# Altium schematic sheet isoDebug-Isolation.SchDoc
size A4
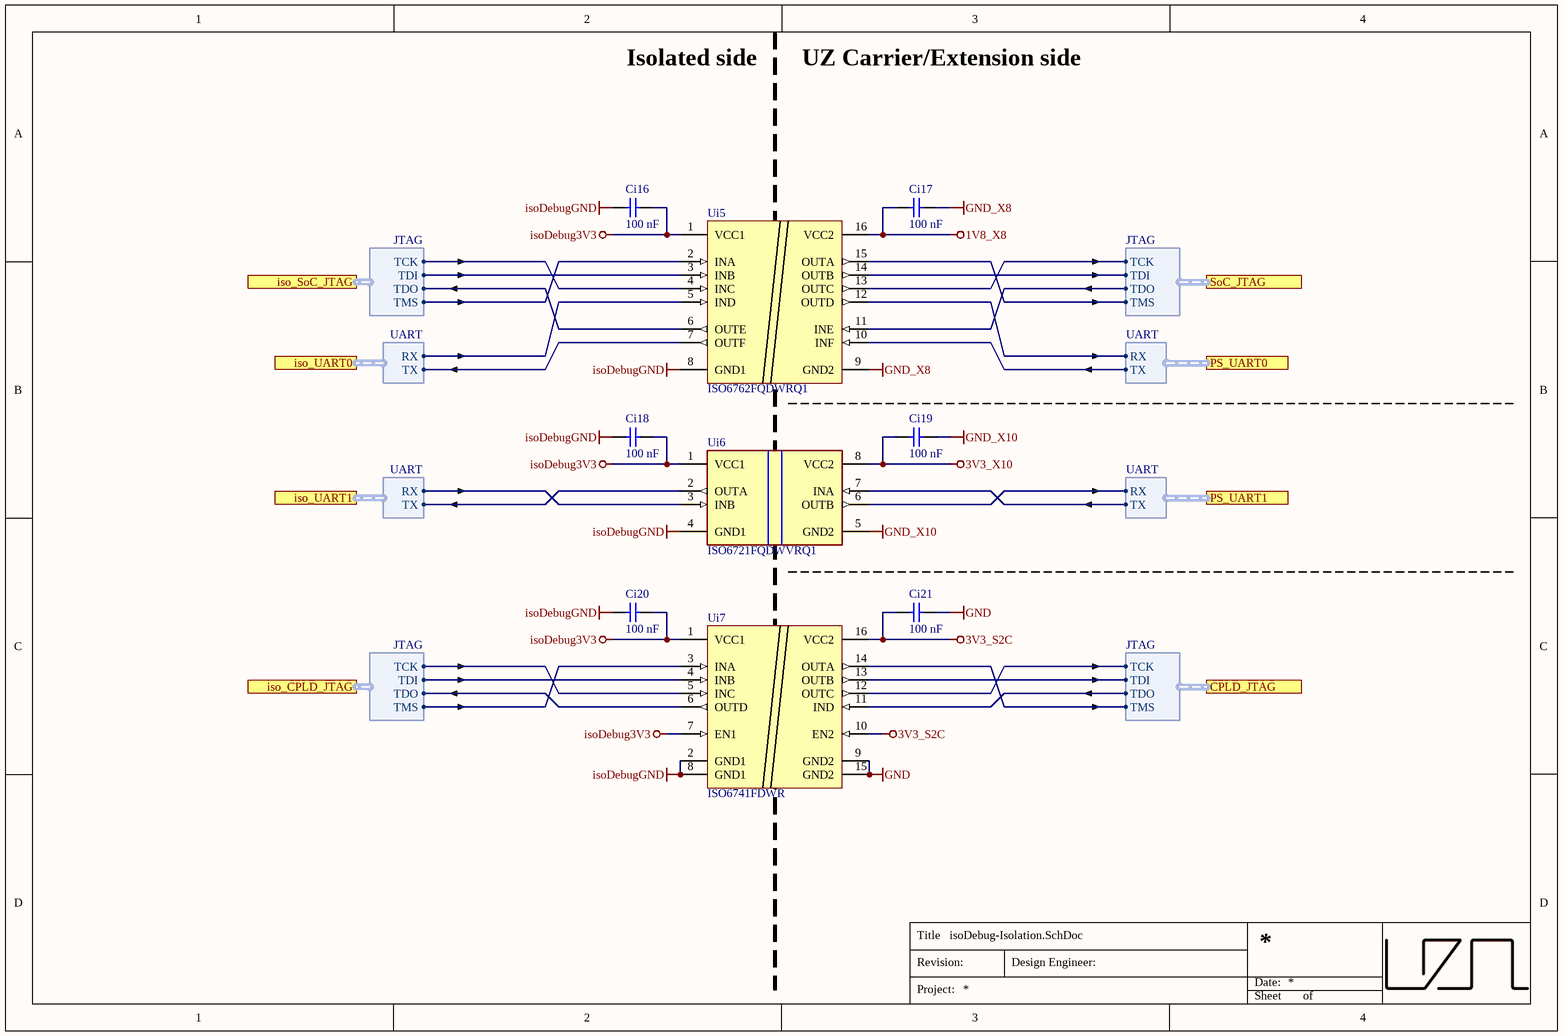
[diagram p0: isoDebug-Isolation.SchDoc]

## Parts
Ci16  100 nF  [C_0402_TE]
Ci17  100 nF  [C_0402_TE]
Ci18  100 nF  [C_0402_TE]
Ci19  100 nF  [C_0402_TE]
Ci20  100 nF  [C_0402_TE]
Ci21  100 nF  [C_0402_TE]
Ui5  ISO6762FQDWRQ1  [SOIC127P1030X265-16N]
Ui6  ISO6721FQDWVRQ1  [FP-DWV0008A-IPC_A]
Ui7  ISO6741FDWR  [SOIC127P1030X265-16N]

## Ports
CPLD_JTAG (harness JTAG), iso_CPLD_JTAG (harness JTAG), iso_SoC_JTAG (harness JTAG), iso_UART0 (harness UART), iso_UART1 (harness UART), PS_UART0 (harness UART), PS_UART1 (harness UART), SoC_JTAG (harness JTAG)

## Harnesses
JTAG: TCK, TDI, TDO, TMS
UART: RX, TX

## Nets
1V8_X8: Ci17.2 Ui5.16(VCC2)
3V3_S2C: Ci21.2 Ui7.10(EN2) Ui7.16(VCC2)
3V3_X10: Ci19.2 Ui6.8(VCC2)
GND: Ci21.1 Ui7.9(GND2) Ui7.15(GND2)
GND_X8: Ci17.1 Ui5.9(GND2)
GND_X10: Ci19.1 Ui6.5(GND2)
isoDebug3V3: Ci16.1 Ci18.1 Ci20.1 Ui5.1(VCC1) Ui6.1(VCC1) Ui7.1(VCC1) Ui7.7(EN1)
isoDebugGND: Ci16.2 Ci18.2 Ci20.2 Ui5.8(GND1) Ui6.4(GND1) Ui7.2(GND1) Ui7.8(GND1)
NetUi5_2: Ui5.2(INA) ; port iso_SoC_JTAG.TMS
NetUi5_3: Ui5.3(INB) ; port iso_SoC_JTAG.TDI
NetUi5_4: Ui5.4(INC) ; port iso_SoC_JTAG.TCK
NetUi5_5: Ui5.5(IND) ; port iso_UART0.RX
NetUi5_6: Ui5.6(OUTE) ; port iso_SoC_JTAG.TDO
NetUi5_7: Ui5.7(OUTF) ; port iso_UART0.TX
NetUi5_10: Ui5.10(INF) ; port PS_UART0.TX
NetUi5_11: Ui5.11(INE) ; port SoC_JTAG.TDO
NetUi5_12: Ui5.12(OUTD) ; port PS_UART0.RX
NetUi5_13: Ui5.13(OUTC) ; port SoC_JTAG.TCK
NetUi5_14: Ui5.14(OUTB) ; port SoC_JTAG.TDI
NetUi5_15: Ui5.15(OUTA) ; port SoC_JTAG.TMS
NetUi6_2: Ui6.2(OUTA) ; port iso_UART1.TX
NetUi6_3: Ui6.3(INB) ; port iso_UART1.RX
NetUi6_6: Ui6.6(OUTB) ; port PS_UART1.RX
NetUi6_7: Ui6.7(INA) ; port PS_UART1.TX
NetUi7_3: Ui7.3(INA) ; port iso_CPLD_JTAG.TMS
NetUi7_4: Ui7.4(INB) ; port iso_CPLD_JTAG.TDI
NetUi7_5: Ui7.5(INC) ; port iso_CPLD_JTAG.TCK
NetUi7_6: Ui7.6(OUTD) ; port iso_CPLD_JTAG.TDO
NetUi7_11: Ui7.11(IND) ; port CPLD_JTAG.TDO
NetUi7_12: Ui7.12(OUTC) ; port CPLD_JTAG.TCK
NetUi7_13: Ui7.13(OUTB) ; port CPLD_JTAG.TDI
NetUi7_14: Ui7.14(OUTA) ; port CPLD_JTAG.TMS

## Notes on the sheet
- Isolated side
- UZ Carrier/Extension side
- Title
- Revision:
- Design Engineer:
- Date:
- Project:
- Sheet
- of

## Library data of the parts
Ci16-Ci21 = UZgen_C_0402_100nF_50V_X7R: Generic capacitor; Manufacturer: UZgen; Tolerance: 10 %; Created from: UZgenTool; Voltage: 50V; Manufacturer Part Number: UZgen_C_0402_100nF_50V_X7R; PartID: 3431; Created On: 02/08/2024 11:17:51; Device Package: 0402; Last Updated: 02/08/2024 11:17:51; Mounting Type: SMD; Value: 100 nF; Technology: X7R
Ui5 = ISO6762FQDWRQ1: ISO676x General-Purpose Six-Channel Reinforced Digital Isolators with Robust EMC; Manufacturer: Texas Instruments; Created from: FRosner; Manufacturer Part Number: ISO6762FQDWRQ1; PartID: 13; Created On: 23/02/2025 18:15:58; ComponentLink1Description: Datasheet; ComponentLink1URL: https://www.ti.com/lit/ds/symlink/iso6762-q1.pdf; Component Type: Digital Isolator; Device Package: SOIC-16; Last Updated: 24/03/2025 19:50:00; Mounting Type: SMD; Operating Temperature: -40 to +125 °C; Series: ISO6762; Supplier 1: Mouser; Supplier Part Number 1: 595-ISO6762FQDWRQ1; Supplier 2: LCSC; Supplier Part Number 2: C5216383; Type: Digital Isolator; Value: ISO6762FQDWRQ1; LCSC Part Number: C5216383
Ui6 = ISO6721FQDWVRQ1: General Purpose Reinforced and Basic Dual-Channel Automotive Digital Isolators with Robust EMC; Manufacturer: Texas Instruments; Created from: FRosner; Manufacturer Part Number: ISO6721FQDWVRQ1; PartID: 14; Created On: 23/02/2025 18:26:28; ComponentLink1Description: Datasheet; ComponentLink1URL: https://www.ti.com/lit/ds/symlink/iso6721-q1.pdf; Component Type: Digital Isolator; Device Package: SOIC-8; Last Updated: 26/03/2025 16:07:30; Mounting Type: SMD; Operating Temperature: -40 to +125 °C; Series: ISO6721; Supplier 1: Mouser; Supplier Part Number 1: 595-ISO6721FQDWVRQ1; Supplier 2: LCSC; Supplier Part Number 2: C5216428; Type: Digital Isolator; Value: ISO6721FQDWVRQ1; LCSC Part Number: C5216428
Ui7 = ISO6741FDWR: Digital Isolators General-purpose, quad-channel, 3/1 digital isolator 16-SOIC -40 to 125; Manufacturer: Texas Instruments; Created from: FRosner; Manufacturer Part Number: ISO6741FDWR; PartID: 6; Created On: 18/06/2024 13:06:34; ComponentLink1Description: Datasheet; ComponentLink1URL: https://www.ti.com/lit/ds/symlink/iso6741.pdf; Component Type: Digital Isolator; Device Package: SOIC-16; Last Updated: 24/03/2025 19:50:00; Mounting Type: SMD; Operating Temperature: -40 to +125 °C; Series: ISO6741; Supplier 1: Mouser; Supplier Part Number 1: 595-ISO6741FDWR; Supplier 2: LCSC; Supplier Part Number 2: C5216433; Type: Digital Isolator; Value: ISO6741FDWR; LCSC Part Number: C5216433